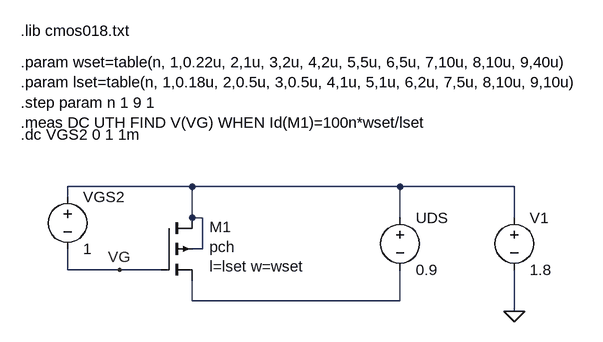
[diagram p0: schematic Draft2P.asc]
Draft2P.asc, the LTspice schematic file:
Version 4
SHEET 1 1356 680
WIRE 224 176 32 176
WIRE 544 176 224 176
WIRE 720 176 544 176
WIRE 32 192 32 176
WIRE 224 224 224 176
WIRE 240 224 224 224
WIRE 544 224 544 176
WIRE 720 224 720 176
WIRE 240 272 240 224
WIRE 240 272 224 272
WIRE 32 304 32 272
WIRE 112 304 32 304
WIRE 176 304 112 304
WIRE 224 352 224 320
WIRE 544 352 544 304
WIRE 544 352 224 352
WIRE 720 368 720 304
FLAG 112 304 VG
FLAG 720 368 0
SYMBOL pmos4 176 224 R0
WINDOW 123 75 75 Left 2
WINDOW 0 75 14 Left 2
WINDOW 3 75 45 Left 2
SYMATTR Value2 l=lset w=wset
SYMATTR InstName M1
SYMATTR Value pch
SYMBOL voltage 32 176 R0
WINDOW 123 0 0 Left 0
WINDOW 39 0 0 Left 0
SYMATTR InstName VGS2
SYMATTR Value 1
SYMBOL voltage 544 208 R0
WINDOW 123 0 0 Left 0
WINDOW 39 0 0 Left 0
SYMATTR InstName UDS
SYMATTR Value 0.9
SYMBOL voltage 720 208 R0
WINDOW 123 0 0 Left 0
WINDOW 39 0 0 Left 0
SYMATTR InstName V1
SYMATTR Value 1.8
TEXT -40 -64 Left 2 !.lib cmos018.txt
TEXT -40 96 Left 2 !.dc VGS2 0 1 1m
TEXT -40 -16 Left 2 !.param wset=table(n, 1,0.22u, 2,1u, 3,2u, 4,2u, 5,5u, 6,5u, 7,10u, 8,10u, 9,40u)\n.param lset=table(n, 1,0.18u, 2,0.5u, 3,0.5u, 4,1u, 5,1u, 6,2u, 7,5u, 8,10u, 9,10u)\n.step param n 1 9 1\n.meas DC UTH FIND V(VG) WHEN Id(M1)=100n*wset/lset

The netlist it stands for:
* Draft2P.asc
M1 N001 VG N002 N001 pch l=lset w=wset
VGS2 N001 VG 1
V§UDS N001 N002 0.9
V1 N001 0 1.8
.model NMOS NMOS
.model PMOS PMOS
.lib standard.mos
.lib cmos018.txt
.dc VGS2 0 1 1m
.param wset=table(n, 1,0.22u, 2,1u, 3,2u, 4,2u, 5,5u, 6,5u, 7,10u, 8,10u, 9,40u)
.param lset=table(n, 1,0.18u, 2,0.5u, 3,0.5u, 4,1u, 5,1u, 6,2u, 7,5u, 8,10u, 9,10u)
.step param n 1 9 1
.meas DC UTH FIND V(VG) WHEN Id(M1)=100n*wset/lset
.backanno
.end